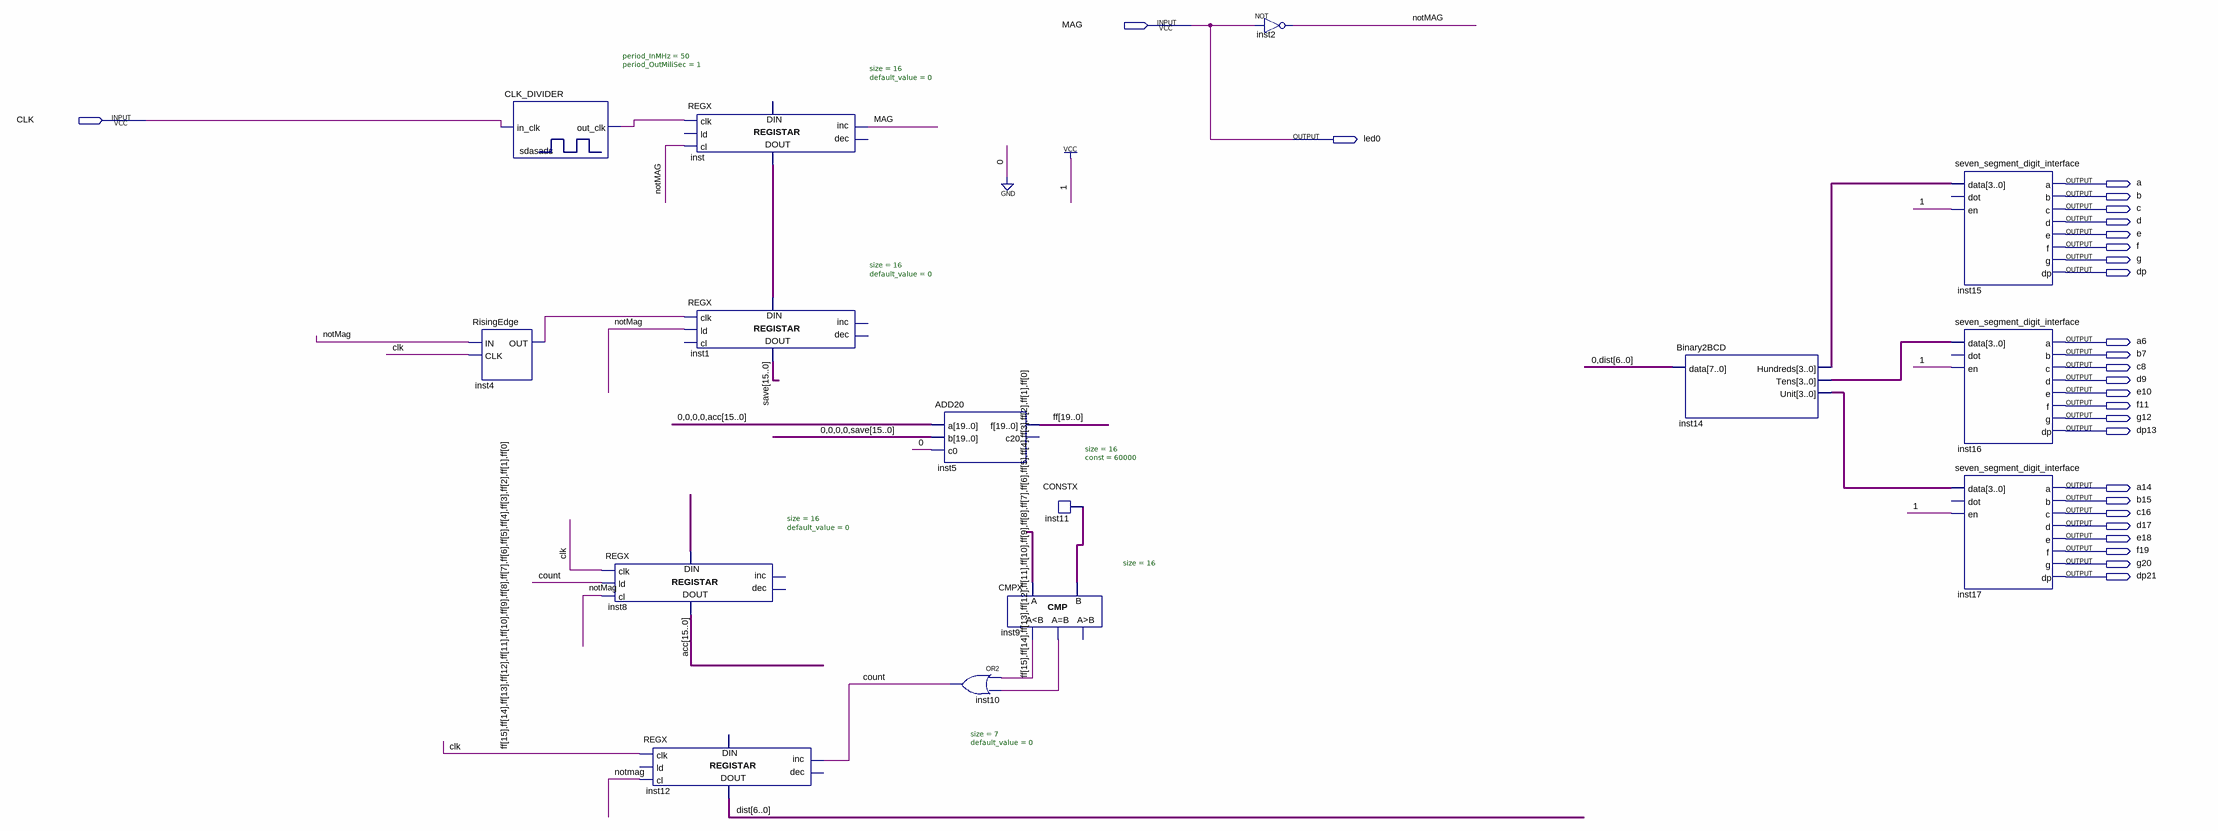
[diagram p0: schematic sheet]
// Quartus schematic senzor.bdf as structural Verilog: 15 symbols, 27 pins
module senzor (
  input  MAG,
  input  CLK,
  output led0,
  output a,
  output b,
  output c,
  output d,
  output e,
  output f,
  output g,
  output dp,
  output a6,
  output b7,
  output c8,
  output d9,
  output e10,
  output f11,
  output g12,
  output dp13,
  output a14,
  output b15,
  output c16,
  output d17,
  output e18,
  output f19,
  output g20,
  output dp21
);

  wire count, inst4_out, inst9_eq, inst9_ls, notMAG, sdasads_out_clk;
  wire [3:0] inst14_hundreds, inst14_tens, inst14_unit;
  wire [6:0] \dist ;
  wire [15:0] acc, inst11_data, inst_data_out, save;
  wire [19:0] ff;

  RisingEdge inst4 (.IN(notMAG), .CLK(CLK), .OUT(inst4_out));
  CLK_DIVIDER #(.period_InMHz(50), .period_OutMiliSec(1)) sdasads (.in_clk(CLK), .out_clk(sdasads_out_clk));
  REGX #(.size(16), .default_value(0)) inst8 (
    .clk(CLK), .ld(count), .cl(notMAG), .data_in(ff[15:0]), .data_out(acc));  // open: inc, dec
  REGX #(.size(7), .default_value(0)) inst12 (
    .clk(CLK), .cl(notMAG), .inc(count), .data_out(\dist ));  // open: ld, dec, data_in
  REGX #(.size(16), .default_value(0)) inst (
    .clk(sdasads_out_clk), .cl(notMAG), .inc(MAG), .data_out(inst_data_out));  // open: ld, dec, data_in
  REGX #(.size(16), .default_value(0)) inst1 (
    .clk(inst4_out), .ld(notMAG), .data_in(inst_data_out), .data_out(save));  // open: cl, inc, dec
  ADD20 inst5 (.a({4'b0000, acc}), .b({4'b0000, save}), .c0(1'b0), .f(ff));  // open: c20
  CMPX #(.size(16)) inst9 (.A(ff[15:0]), .B(inst11_data), .ls(inst9_ls), .eq(inst9_eq));  // open: gr
  or inst10 (count, inst9_ls, inst9_eq);
  CONSTX #(.size(16), .\const (60000)) inst11 (.data(inst11_data));
  not inst2 (notMAG, MAG);
  Binary2BCD inst14 (.data({1'b0, \dist }), .Hundreds(inst14_hundreds), .Tens(inst14_tens), .Unit(inst14_unit));
  seven_segment_digit_interface inst15 (
    .data(inst14_hundreds), .en(1'b1), .a(a), .b(b), .c(c), .d(d), .e(e), .f(f), .g(g), .dp(dp));  // open: dot
  seven_segment_digit_interface inst16 (
    .data(inst14_tens), .en(1'b1), .a(a6), .b(b7), .c(c8), .d(d9), .e(e10), .f(f11), .g(g12), .dp(dp13));  // open: dot
  seven_segment_digit_interface inst17 (
    .data(inst14_unit), .en(1'b1), .a(a14), .b(b15), .c(c16), .d(d17), .e(e18), .f(f19), .g(g20), .dp(dp21));  // open: dot

  assign led0 = MAG;
endmodule
